# EAGLE design EIB36-JAE_FB-Av1 (EAGLE 9.2.2)
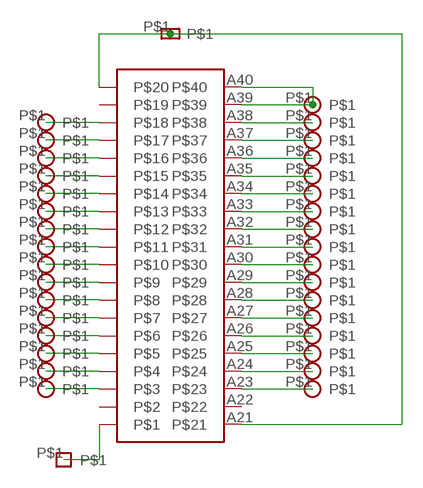
[diagram p0: schematic, sheet 1]

## Parts
U$1  WR-40SB-VFH30  [WR-40SB-VFH30]
U$2  EIB-GND-HOLE-PAD-SMALL  [EIB-GND-HOLE-PAD-SMALL]
U$3  EIB-GND-HOLE-PAD  [EIB-GND-HOLE-PAD]
U$5  EIB-TETRODE-HOLE-PAD  [EIB-TETRODE-HOLE-PAD]
U$6  EIB-TETRODE-HOLE-PAD  [EIB-TETRODE-HOLE-PAD]
U$7  EIB-TETRODE-HOLE-PAD  [EIB-TETRODE-HOLE-PAD]
U$8  EIB-TETRODE-HOLE-PAD  [EIB-TETRODE-HOLE-PAD]
U$9  EIB-TETRODE-HOLE-PAD  [EIB-TETRODE-HOLE-PAD]
U$10  EIB-TETRODE-HOLE-PAD  [EIB-TETRODE-HOLE-PAD]
U$11  EIB-TETRODE-HOLE-PAD  [EIB-TETRODE-HOLE-PAD]
U$12  EIB-TETRODE-HOLE-PAD  [EIB-TETRODE-HOLE-PAD]
U$13  EIB-TETRODE-HOLE-PAD  [EIB-TETRODE-HOLE-PAD]
U$14  EIB-TETRODE-HOLE-PAD  [EIB-TETRODE-HOLE-PAD]
U$15  EIB-TETRODE-HOLE-PAD  [EIB-TETRODE-HOLE-PAD]
U$16  EIB-TETRODE-HOLE-PAD  [EIB-TETRODE-HOLE-PAD]
U$17  EIB-TETRODE-HOLE-PAD  [EIB-TETRODE-HOLE-PAD]
U$18  EIB-TETRODE-HOLE-PAD  [EIB-TETRODE-HOLE-PAD]
U$19  EIB-TETRODE-HOLE-PAD  [EIB-TETRODE-HOLE-PAD]
U$20  EIB-TETRODE-HOLE-PAD  [EIB-TETRODE-HOLE-PAD]
U$22  EIB-TETRODE-HOLE-PAD  [EIB-TETRODE-HOLE-PAD]
U$23  EIB-TETRODE-HOLE-PAD  [EIB-TETRODE-HOLE-PAD]
U$24  EIB-TETRODE-HOLE-PAD  [EIB-TETRODE-HOLE-PAD]
U$25  EIB-TETRODE-HOLE-PAD  [EIB-TETRODE-HOLE-PAD]
U$26  EIB-TETRODE-HOLE-PAD  [EIB-TETRODE-HOLE-PAD]
U$27  EIB-TETRODE-HOLE-PAD  [EIB-TETRODE-HOLE-PAD]
U$28  EIB-TETRODE-HOLE-PAD  [EIB-TETRODE-HOLE-PAD]
U$29  EIB-TETRODE-HOLE-PAD  [EIB-TETRODE-HOLE-PAD]
U$30  EIB-TETRODE-HOLE-PAD  [EIB-TETRODE-HOLE-PAD]
U$31  EIB-TETRODE-HOLE-PAD  [EIB-TETRODE-HOLE-PAD]
U$32  EIB-TETRODE-HOLE-PAD  [EIB-TETRODE-HOLE-PAD]
U$33  EIB-TETRODE-HOLE-PAD  [EIB-TETRODE-HOLE-PAD]
U$34  EIB-TETRODE-HOLE-PAD  [EIB-TETRODE-HOLE-PAD]
U$35  EIB-TETRODE-HOLE-PAD  [EIB-TETRODE-HOLE-PAD]
U$36  EIB-TETRODE-HOLE-PAD  [EIB-TETRODE-HOLE-PAD]
U$37  EIB-TETRODE-HOLE-PAD  [EIB-TETRODE-HOLE-PAD]
U$38  EIB-TETRODE-HOLE-PAD  [EIB-TETRODE-HOLE-PAD]

## Nets
N$1: U$1.A20 U$1.A21 U$2.P$1
N$2: U$1.A1 U$3.P$1
N$6: U$1.A18 U$5.P$1
N$7: U$1.A17 U$6.P$1
N$8: U$1.A16 U$7.P$1
N$9: U$1.A15 U$8.P$1
N$10: U$1.A14 U$9.P$1
N$11: U$1.A13 U$10.P$1
N$12: U$1.A12 U$11.P$1
N$13: U$1.A11 U$12.P$1
N$14: U$1.A10 U$13.P$1
N$15: U$1.A9 U$14.P$1
N$16: U$1.A8 U$15.P$1
N$17: U$1.A7 U$16.P$1
N$18: U$1.A6 U$17.P$1
N$19: U$1.A5 U$18.P$1
N$20: U$1.A4 U$19.P$1
N$21: U$1.A3 U$20.P$1
N$23: U$1.A39 U$1.A40 U$22.P$1
N$24: U$1.A38 U$23.P$1
N$25: U$1.A37 U$24.P$1
N$26: U$1.A36 U$25.P$1
N$27: U$1.A35 U$26.P$1
N$28: U$1.A34 U$27.P$1
N$29: U$1.A33 U$28.P$1
N$30: U$1.A32 U$29.P$1
N$31: U$1.A31 U$30.P$1
N$32: U$1.A30 U$31.P$1
N$33: U$1.A29 U$32.P$1
N$34: U$1.A28 U$33.P$1
N$35: U$1.A27 U$34.P$1
N$36: U$1.A26 U$35.P$1
N$37: U$1.A25 U$36.P$1
N$38: U$1.A24 U$37.P$1
N$39: U$1.A23 U$38.P$1
Unconnected: U$1.A2 U$1.A19 U$1.A22

## Library data of the parts
U$1 = EIBLibrary:WR-40SB-VFH30
U$2 = EIBLibrary:EIB-GND-HOLE-PAD-SMALL
U$3 = EIBLibrary:EIB-GND-HOLE-PAD
U$5-U$20 U$22-U$38 = EIBLibrary:EIB-TETRODE-HOLE-PAD

## Board
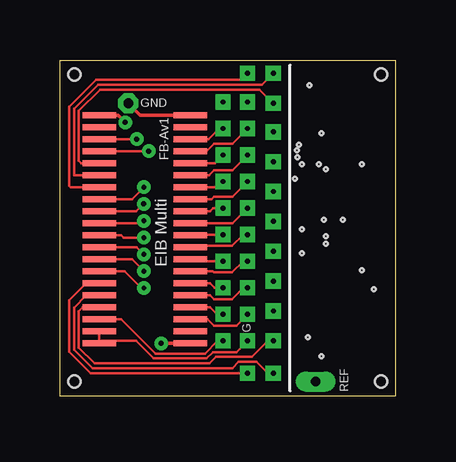
[diagram p1: board, top side]
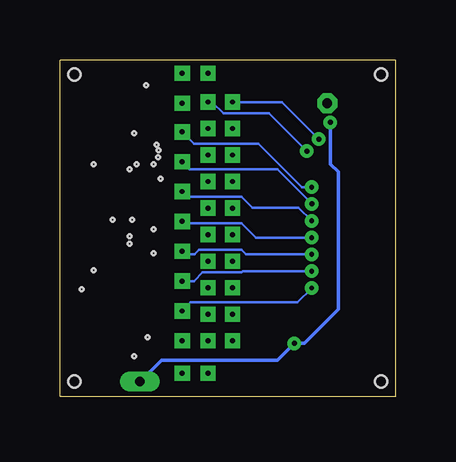
[diagram p2: board, bottom side, seen from below]

Size 14 x 14 mm. Coordinates in mm from the lower left corner, seen from the top.
Outline: 0,14 14,14 14,0 0,0 0,14
Copper layers (1*16): Top 0.035mm / dielectric 1mm / Bottom 0.035mm
Design rules "default *": minimum track width 0.1mm, minimum drill 0.15mm, track to track 0.1mm, track to pad 0.1mm, pad to pad 0.1mm, via to via 0.1mm, smd to smd 0.1mm, copper to edge 6mil, drill to drill 0.1mm, minimum pad ring 0.22mm, minimum via ring 0.18mm, stop-mask expansion 4mil, vias tented up to drill 0mil, thermal gap 5mil
Holes 0.5 mm at 13.4,0.6 0.6,13.4 0.6,0.6 13.4,13.4
Holes 0.15 mm at 10.4,12.95 10.9,10.95 9.97,10.47 9.9,9.95 10.1,9.65 11.1,9.45 9.8,9.05 11,7.35 11.8,7.35 10.1,6.95 11.1,6.65 11.1,6.35 12.6,5.25 13.1,4.45 10.35,2.45 10.9,1.65 9.88,10.23 10.1,5.95 10.8,9.65 12.6,9.65

### Footprints (pad centres in the part's own frame; a part is rotated, then mirrored left to right if it is on the bottom)
WR-40SB-VFH30 = smd 0.25 x 1.4: A1 0,0; A2 0.5,0; A3 1,0; A4 1.5,0; A5 2,0; A6 2.5,0; A7 3,0; A8 3.5,0; A9 4,0; A10 4.5,0; A11 5,0; A12 5.5,0; A13 6,0; A14 6.5,0; A15 7,0; A16 7.5,0; A17 8,0; A18 8.5,0; A19 9,0; A20 9.5,0; A21 0,-3.8; A22 0.5,-3.8; A23 1,-3.8; A24 1.5,-3.8; A25 2,-3.8; A26 2.5,-3.8; A27 3,-3.8; A28 3.5,-3.8; A29 4,-3.8; A30 4.5,-3.8; A31 5,-3.8; A32 5.5,-3.8; A33 6,-3.8; A34 6.5,-3.8; A35 7,-3.8; A36 7.5,-3.8; A37 8,-3.8; A38 8.5,-3.8; A39 9,-3.8; A40 9.5,-3.8
EIB-GND-HOLE-PAD-SMALL = drill 0.4 pad 0.41 long: P$1 0,0
EIB-GND-HOLE-PAD = drill 0.4 pad 0.8 octagon: P$1 0,0
EIB-TETRODE-HOLE-PAD = drill 0.2 pad 0.34 square: P$1 0,0

### Placement (x,y rotation side)
U$1  5.44,11.7 270 top
U$2  10.66,0.6 0 top
U$3  2.85,12.2 270 top
U$5  7.83,3.41 90 top
U$6  6.8,3.41 90 top
U$7  7.83,4.51 90 top
U$8  6.8,4.51 90 top
U$9  7.83,5.62 90 top
U$10  6.8,5.62 0 top
U$11  7.83,6.72 0 top
U$12  6.8,6.72 0 top
U$13  7.83,7.83 0 top
U$14  6.8,7.83 0 top
U$15  7.83,8.93 0 top
U$16  6.8,8.93 90 top
U$17  7.83,10.04 90 top
U$18  6.8,10.04 90 top
U$19  7.83,11.14 90 top
U$20  6.8,11.14 90 top
U$22  7.83,2.3 0 top
U$23  6.8,2.3 0 top
U$24  8.9,2.3 0 top
U$25  8.9,0.95 0 top
U$26  7.83,0.95 0 top
U$27  8.9,3.54 180 top
U$28  8.9,4.79 180 top
U$29  8.9,6.03 180 top
U$30  8.9,7.28 180 top
U$31  8.9,8.52 0 top
U$32  8.9,9.76 0 top
U$33  8.9,11.01 0 top
U$34  7.83,13.45 180 top
U$35  8.9,13.45 270 top
U$36  8.9,12.2 90 top
U$37  7.83,12.25 90 top
U$38  6.8,12.25 90 top

### Tracks (layer width: path | path; a pad name or v marks a point on that pad's centre or on a via)
N$1  (via drill 0.2)
  Top 0.15: U$1.A21 2.42,11.7 v2.72,11.4 | U$1.A20 v4.23,2.2 v4.22,2.19
  Bottom 0.15: v2.72,11.4 2.72,9.66 2.4,9.34 2.4,3.6 3.81,2.19 v4.22,2.19 4.92,1.5 9.76,1.5 U$2.P$1
N$2
  Top 0.15: U$3.P$1 3.35,11.7 U$1.A1
N$6
  Top 0.1: U$1.A18 6.15,3.2 6.42,2.94 7.36,2.94 U$5.P$1
N$7
  Top 0.1: U$6.P$1 6.54,3.41 6.25,3.7 U$1.A17
N$8
  Top 0.1: U$7.P$1 7.65,4.51 7.18,4.04 6.42,4.04 6.26,4.2 U$1.A16
N$9
  Top 0.1: U$8.P$1 6.44,4.51 6.25,4.7 U$1.A15
N$10
  Top 0.1: U$9.P$1 7.65,5.62 7.18,5.15 6.42,5.15 6.37,5.2 U$1.A14
N$11
  Top 0.1: U$10.P$1 5.52,5.62 U$1.A13
N$12
  Top 0.1: U$11.P$1 7.65,6.72 7.18,6.25 5.49,6.25 U$1.A12
N$13
  Top 0.1: U$12.P$1 5.46,6.72 U$1.A11
N$14
  Top 0.1: U$13.P$1 7.2,7.2 U$1.A10
N$15
  Top 0.1: U$14.P$1 6.38,7.83 6.25,7.7 U$1.A9
N$16
  Top 0.1: U$15.P$1 7.19,8.3 6.42,8.3 6.32,8.2 U$1.A8
N$17
  Top 0.1: U$16.P$1 6.57,8.7 U$1.A7
N$18
  Top 0.1: U$17.P$1 7.19,9.4 6.42,9.4 6.21,9.2 U$1.A6
N$19
  Top 0.1: U$18.P$1 6.46,9.7 U$1.A5
N$20
  Top 0.1: U$1.A4 6.11,10.2 6.42,10.51 7.19,10.51 U$19.P$1
N$21
  Top 0.1: U$20.P$1 6.64,11.14 6.2,10.7 U$1.A3
N$23
  Top 0.1: U$1.A39 U$1.A40 1.74,2.3 3.17,2.3 3.9,1.56 6.12,1.56 6.39,1.83 7.36,1.83 U$22.P$1
N$24
  Top 0.1: U$1.A38 2.55,3.2 3.98,1.76 6.04,1.76 6.58,2.3 U$23.P$1
N$25
  Top 0.1: U$1.A37 0.95,3.7 0.79,3.54 0.79,2.01 1.44,1.36 6.24,1.36 6.5,1.63 8.01,1.63 8.68,2.3 U$24.P$1
N$26
  Top 0.1: U$1.A36 1.1,4.2 0.59,3.69 0.59,1.93 1.35,1.17 7.19,1.17 7.44,1.42 8.21,1.42 8.68,0.95 U$25.P$1
N$27
  Top 0.1: U$1.A35 1.1,4.7 0.39,3.99 0.39,1.85 1.29,0.95 U$26.P$1
N$28  (via drill 0.2)
  Top 0.1: v3.5,4.5 3.4,4.5 2.7,5.2 U$1.A34
  Bottom 0.1: v3.5,4.5 4.1,3.9 8.54,3.9 U$27.P$1
N$29  (via drill 0.2)
  Top 0.1: v3.5,5.2 3,5.7 U$1.A33
  Bottom 0.1: v3.5,5.2 6.37,5.2 6.42,5.15 8.05,5.15 8.41,4.79 U$28.P$1
N$30  (via drill 0.2)
  Top 0.1: v3.5,5.9 3.2,6.2 U$1.A32
  Bottom 0.1: U$29.P$1 8.77,5.9 8.39,5.9 8.21,6.09 6.42,6.09 6.23,5.9 v3.5,5.9
N$31  (via drill 0.2)
  Top 0.1: v3.5,6.6 2.65,6.6 2.55,6.7 U$1.A31
  Bottom 0.1: v3.5,6.6 5.83,6.6 6.42,7.19 6.99,7.19 7,7.2 8.82,7.2 U$30.P$1
N$32  (via drill 0.2)
  Top 0.1: v3.5,7.3 3.4,7.2 U$1.A30
  Bottom 0.1: U$31.P$1 8.68,8.3 6.42,8.3 5.97,7.85 4.05,7.85 v3.5,7.3
N$33  (via drill 0.2 pad 0.55)
  Top 0.1: v3.49,8.01 3.18,7.7 U$1.A29
  Bottom 0.1: v3.49,8.01 4.93,9.45 8.59,9.45 U$32.P$1
N$34  (via drill 0.2 pad 0.55)
  Top 0.1: v3.5,8.7 3,8.2 U$1.A28
  Bottom 0.1: v3.5,8.7 3.9,8.7 5.71,10.51 8.4,10.51 U$33.P$1
N$35
  Top 0.1: U$34.P$1 7.8,13.17 1.51,13.17 0.39,12.05 0.39,8.76 0.45,8.7 U$1.A27
N$36
  Top 0.1: U$35.P$1 8.42,12.97 1.59,12.97 0.59,11.97 0.59,9.21 0.6,9.2 U$1.A26
N$37
  Top 0.1: U$1.A25 0.89,9.7 0.79,9.8 0.79,11.89 1.67,12.77 8.33,12.77 U$36.P$1
N$38  (via drill 0.2)
  Top 0.1: U$1.A24 v3.7,10.2
  Bottom 0.1: U$37.P$1 7.65,12.25 7.18,11.78 5.28,11.78 v3.7,10.2
N$39  (via drill 0.2)
  Top 0.1: U$1.A23 v3.2,10.7
  Bottom 0.1: v3.2,10.7 4.75,12.25 U$38.P$1

### Text on the board
tPlace: GND | EIB Multi | G | REF
tNames: FB-Av1